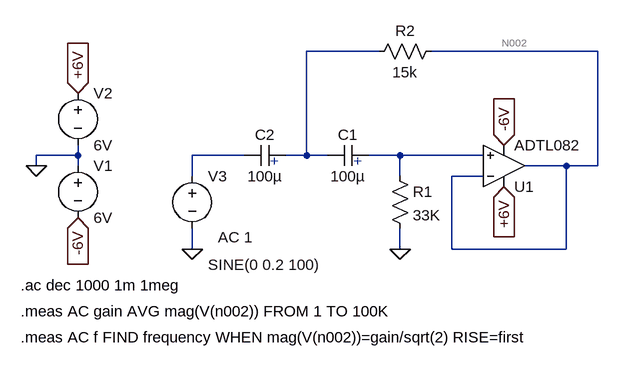
[diagram p0: schematic 50mHz_HPF.asc]
50mHz_HPF.asc, the LTspice schematic file:
Version 4
SHEET 1 880 680
WIRE 240 -32 128 -32
WIRE 576 -32 320 -32
WIRE -224 128 -224 112
WIRE -224 128 -288 128
WIRE 32 128 -48 128
WIRE 128 128 128 -32
WIRE 128 128 96 128
WIRE 160 128 128 128
WIRE 272 128 224 128
WIRE 400 128 272 128
WIRE -288 144 -288 128
WIRE -224 144 -224 128
WIRE 528 144 464 144
WIRE 576 144 576 -32
WIRE 576 144 528 144
WIRE -48 160 -48 128
WIRE 272 160 272 128
WIRE 400 160 352 160
WIRE -48 272 -48 240
WIRE 272 272 272 240
WIRE 352 272 352 160
WIRE 528 272 528 144
WIRE 528 272 352 272
FLAG -224 32 +6V
IOPIN -224 32 In
FLAG 432 176 +6V
IOPIN 432 176 In
FLAG -224 224 -6V
IOPIN -224 224 In
FLAG 432 112 -6V
IOPIN 432 112 In
FLAG -288 144 0
FLAG 272 272 0
FLAG -48 272 0
SYMBOL voltage -224 128 R0
WINDOW 123 0 0 Left 0
WINDOW 39 0 0 Left 0
SYMATTR InstName V1
SYMATTR Value 6V
SYMBOL voltage -224 16 R0
WINDOW 123 0 0 Left 0
WINDOW 39 0 0 Left 0
SYMATTR InstName V2
SYMATTR Value 6V
SYMBOL OpAmps\\ADTL082 432 208 M180
SYMATTR InstName U1
SYMBOL res 256 144 R0
SYMATTR InstName R1
SYMATTR Value 33K
SYMBOL cap 224 112 R90
WINDOW 0 0 32 VBottom 2
WINDOW 3 32 32 VTop 2
SYMATTR InstName C1
SYMATTR Value 100µ
SYMBOL cap 96 112 R90
WINDOW 0 0 32 VBottom 2
WINDOW 3 32 32 VTop 2
SYMATTR InstName C2
SYMATTR Value 100µ
SYMBOL res 336 -48 R90
WINDOW 0 0 56 VBottom 2
WINDOW 3 32 56 VTop 2
SYMATTR InstName R2
SYMATTR Value 15k
SYMBOL voltage -48 144 R0
WINDOW 3 24 152 Left 2
WINDOW 123 40 110 Left 2
WINDOW 39 0 0 Left 0
SYMATTR Value SINE(0 0.2 100)
SYMATTR Value2 AC 1
SYMATTR InstName V3
TEXT -312 328 Left 2 !.ac dec 1000 1m 1meg
TEXT -312 368 Left 2 !.meas AC gain AVG mag(V(n002)) FROM 1 TO 100K
TEXT -312 408 Left 2 !.meas AC f FIND frequency WHEN mag(V(n002))=gain/sqrt(2) RISE=first
TEXT 72 136 Left 2 ;+
TEXT 200 136 Left 2 ;+

The netlist it stands for:
* 50mHz_HPF.asc
V1 0 -6V 6V
V2 +6V 0 6V
XU1 N004 N002 +6V -6V N002 ADTL082  ; pins In+ In- V+ V- OUT
R1 N004 0 33K
C1 N004 N001 100µ
C2 N001 N003 100µ
R2 N002 N001 15k
V3 N003 0 SINE(0 0.2 100) AC 1
.ac dec 1000 1m 1meg
.meas AC gain AVG mag(V(n002)) FROM 1 TO 100K
.meas AC f FIND frequency WHEN mag(V(n002))=gain/sqrt(2) RISE=first
* +
* +
.lib ADI.lib
.backanno
.end